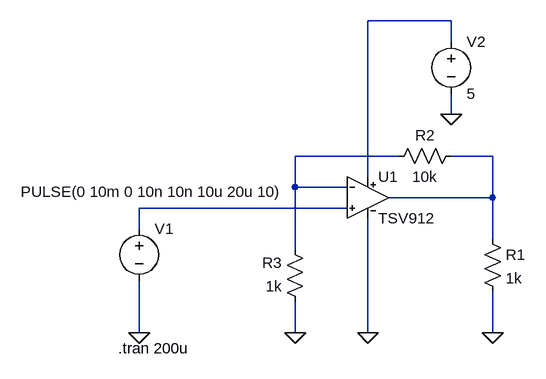
[diagram p0: schematic tsv-2.asc]
tsv-2.asc, the LTspice schematic file:
Version 4
SHEET 1 880 680
WIRE 320 -144 192 -144
WIRE 320 -112 320 -144
WIRE 320 0 320 -32
WIRE 240 64 80 64
WIRE 384 64 320 64
WIRE 192 96 192 -144
WIRE 80 112 80 64
WIRE 160 112 80 112
WIRE 384 128 384 64
WIRE 384 128 224 128
WIRE 160 144 -160 144
WIRE -160 176 -160 144
WIRE 384 192 384 128
WIRE 80 208 80 112
WIRE -160 336 -160 256
WIRE 80 336 80 288
WIRE 192 336 192 160
WIRE 384 336 384 272
FLAG -160 336 0
FLAG 80 336 0
FLAG 192 336 0
FLAG 384 336 0
FLAG 320 0 0
SYMBOL TSV912 192 64 R0
SYMATTR InstName U1
SYMBOL voltage -160 160 R0
WINDOW 123 0 0 Left 0
WINDOW 39 0 0 Left 0
WINDOW 3 -182 -41 Left 0
SYMATTR InstName V1
SYMATTR Value PULSE(0 10m 0 10n 10n 10u 20u 10)
SYMBOL voltage 320 -128 R0
WINDOW 123 0 0 Left 0
WINDOW 39 0 0 Left 0
SYMATTR InstName V2
SYMATTR Value 5
SYMBOL res 368 176 R0
SYMATTR InstName R1
SYMATTR Value 1k
SYMBOL res 336 48 R90
WINDOW 0 0 56 VBottom 0
WINDOW 3 32 56 VTop 0
SYMATTR InstName R2
SYMATTR Value 10k
SYMBOL res 96 304 R180
WINDOW 0 36 76 Left 0
WINDOW 3 36 40 Left 0
SYMATTR InstName R3
SYMATTR Value 1k
TEXT -192 360 Left 0 !.tran 200u

The netlist it stands for:
* tsv-2.asc
XU1 N002 N004 N003 N001 0 TSV912 TSV912 TSV912.mod TSV912  ; pins In- In+ OUT V+ V-
V1 N004 0 PULSE(0 10m 0 10n 10n 10u 20u 10)
V2 N001 0 5
R1 N003 0 1k
R2 N003 N002 10k
R3 0 N002 1k
.tran 200u
.lib TSV912.mod
.backanno
.end